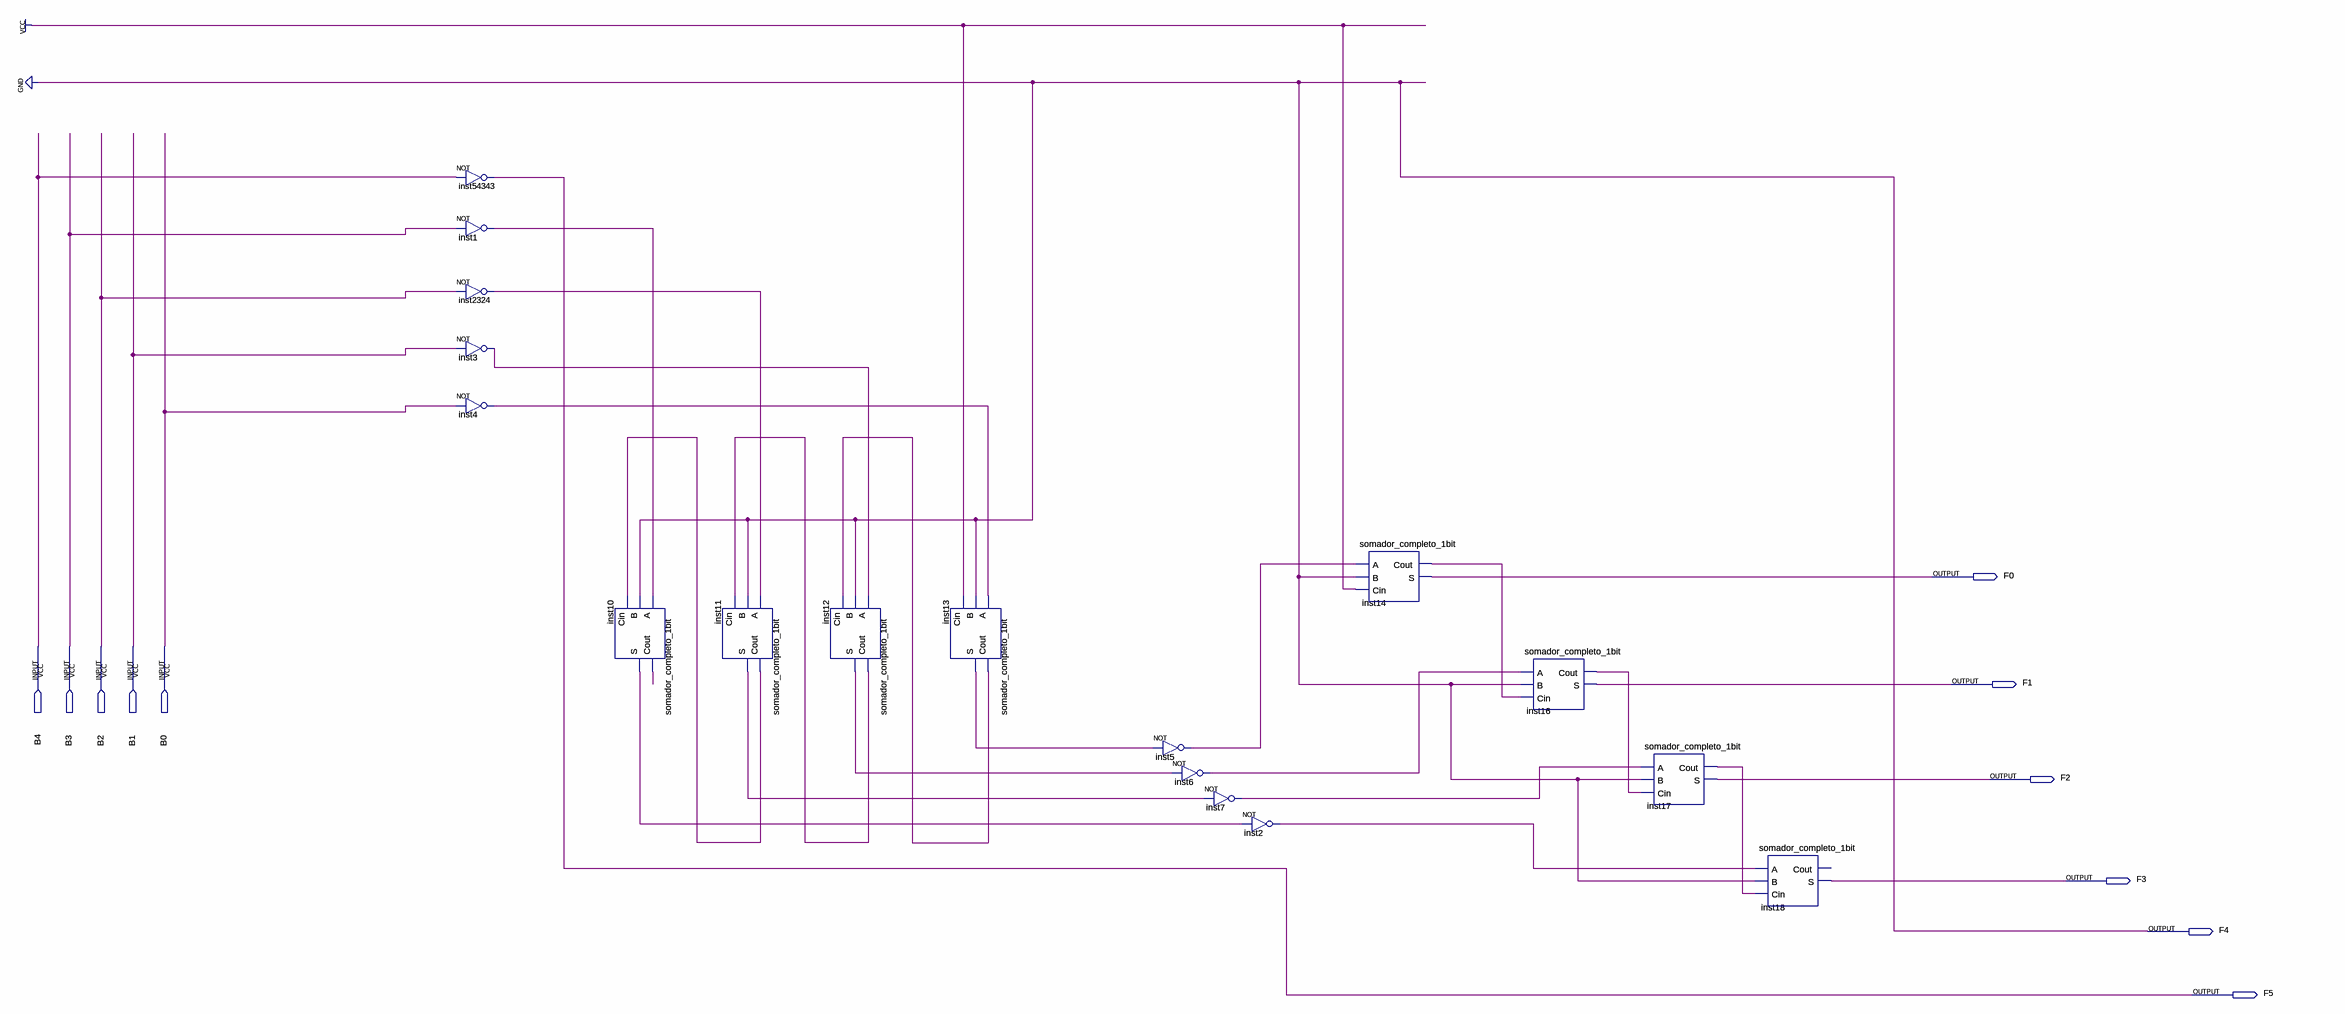
[diagram p0: schematic sheet]
// Quartus schematic complemento.bdf as structural Verilog: 34 symbols, 22 pins
module complemento (
  input  B4,
  input  B3,
  input  B2,
  input  B1,
  input  B0,
  output F0,
  output F1,
  output F2,
  output F3,
  output F4,
  output F5
);

  wire inst1_out, inst2_out, inst3_out, inst4_out, inst5_out, inst6_out, inst7_out, inst10_cout, inst10_s,
       inst11_cout, inst11_s, inst12_cout, inst12_s, inst13_cout, inst13_s, inst14_cout, inst16_cout,
       inst17_cout, inst18_cout, inst2324_out;

  not inst54343 (F5, B4);
  not inst54343_dup2 (F5, B4);
  not inst1 (inst1_out, B3);
  not inst1_dup2 (inst1_out, B3);
  not inst2324 (inst2324_out, B2);
  not inst2324_dup2 (inst2324_out, B2);
  not inst3 (inst3_out, B1);
  not inst3_dup2 (inst3_out, B1);
  not inst4 (inst4_out, B0);
  not inst4_dup2 (inst4_out, B0);
  somador_completo_1bit inst10 (.A(inst1_out), .B(1'b0), .Cin(inst11_cout), .Cout(inst10_cout), .S(inst10_s));
  somador_completo_1bit inst10_dup2 (.A(inst1_out), .B(1'b0), .Cin(inst11_cout), .Cout(inst10_cout), .S(inst10_s));
  somador_completo_1bit inst11 (.A(inst2324_out), .B(1'b0), .Cin(inst12_cout), .Cout(inst11_cout), .S(inst11_s));
  somador_completo_1bit inst11_dup2 (.A(inst2324_out), .B(1'b0), .Cin(inst12_cout), .Cout(inst11_cout), .S(inst11_s));
  somador_completo_1bit inst12 (.A(inst3_out), .B(1'b0), .Cin(inst13_cout), .Cout(inst12_cout), .S(inst12_s));
  somador_completo_1bit inst12_dup2 (.A(inst3_out), .B(1'b0), .Cin(inst13_cout), .Cout(inst12_cout), .S(inst12_s));
  somador_completo_1bit inst13 (.A(inst4_out), .B(1'b0), .Cin(1'b1), .Cout(inst13_cout), .S(inst13_s));
  somador_completo_1bit inst13_dup2 (.A(inst4_out), .B(1'b0), .Cin(1'b1), .Cout(inst13_cout), .S(inst13_s));
  not inst5 (inst5_out, inst13_s);
  not inst5_dup2 (inst5_out, inst13_s);
  not inst6 (inst6_out, inst12_s);
  not inst6_dup2 (inst6_out, inst12_s);
  not inst7 (inst7_out, inst11_s);
  not inst7_dup2 (inst7_out, inst11_s);
  not inst2 (inst2_out, inst10_s);
  not inst2_dup2 (inst2_out, inst10_s);
  somador_completo_1bit inst14 (.A(inst5_out), .B(1'b0), .Cin(1'b1), .Cout(inst14_cout), .S(F0));
  somador_completo_1bit inst14_dup2 (.A(inst5_out), .B(1'b0), .Cin(1'b1), .Cout(inst14_cout), .S(F0));
  somador_completo_1bit inst16 (.A(inst6_out), .B(1'b0), .Cin(inst14_cout), .Cout(inst16_cout), .S(F1));
  somador_completo_1bit inst16_dup2 (.A(inst6_out), .B(1'b0), .Cin(inst14_cout), .Cout(inst16_cout), .S(F1));
  somador_completo_1bit inst17 (.A(inst7_out), .B(1'b0), .Cin(inst16_cout), .Cout(inst17_cout), .S(F2));
  somador_completo_1bit inst17_dup2 (.A(inst7_out), .B(1'b0), .Cin(inst16_cout), .Cout(inst17_cout), .S(F2));
  somador_completo_1bit inst18 (.A(inst2_out), .B(1'b0), .Cin(inst17_cout), .Cout(inst18_cout), .S(F3));
  somador_completo_1bit inst18_dup2 (.A(inst2_out), .B(1'b0), .Cin(inst17_cout), .Cout(inst18_cout), .S(F3));

  assign F4 = 1'b0;
endmodule
